# Altium schematic sheet DC-DC_Controller.SchDoc: DC-DC Controller
size A4; CompanyName: swissEmbedded GmbH; Organization: swissEmbedded GmbH; Address1: Landstrasse 18; Address2: 5415 Rieden; Address3: Switzerland; Address4: info@swissembedded.com; DocumentNumber: 1; Revision: A; SheetNumber: 1; SheetTotal: 27
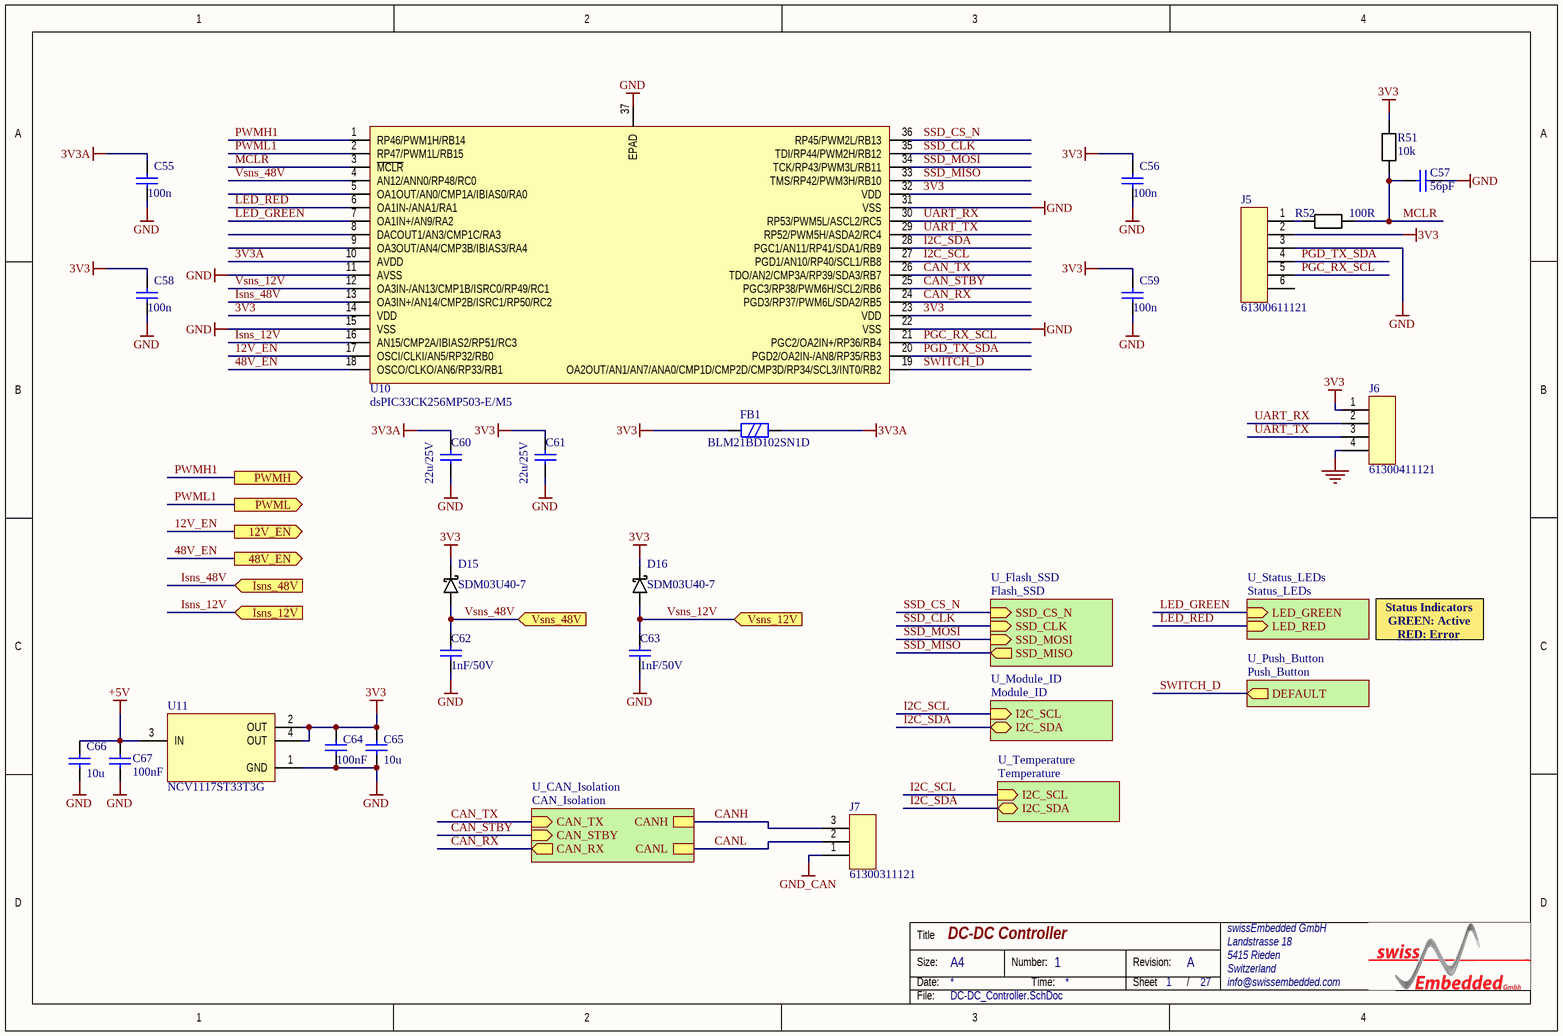
[diagram p0: DC-DC_Controller.SchDoc]

## Parts
C55  100n  [C0603]
C56  100n  [C0603]
C57  56pF  [C0603]
C58  100n  [C0603]
C59  100n  [C0603]
C60  22u/25V  [C0805]
C61  22u/25V  [C0805]
C62  1nF/50V  [C0603]
C63  1nF/50V  [C0603]
C64  100nF  [C0603]
C65  10u  [C1206]
C66  10u  [C1206]
C67  100nF  [C0603]
D15  SDM03U40-7  [SOD523]
D16  SDM03U40-7  [SOD523]
FB1  BLM21BD102SN1D  [R0805]
J5  61300611121  [Header-2.54m-6pin]
J6  61300411121  [Header-2.54m-4pin]
J7  61300311121  [Header-2.54m-3pin]
R51  10k  [R0603]
R52  100R  [R0603]
U10  dsPIC33CK256MP503-E/M5  [UQFN-36]
U11  NCV1117ST33T3G  [SOT223-3]

## Sub-sheets
U_CAN_Isolation = CAN_Isolation: CAN_TX (in), CAN_RX (out), CAN_STBY (in), CANH, CANL
U_Flash_SSD = Flash_SSD: SSD_CS_N (in), SSD_CLK (in), SSD_MOSI (in), SSD_MISO (out)
U_Module_ID = Module_ID: I2C_SCL (in), I2C_SDA (bidir)
U_Push_Button = Push_Button: DEFAULT (out)
U_Status_LEDs = Status_LEDs: LED_RED (in), LED_GREEN (in)
U_Temperature = Temperature: I2C_SCL (in), I2C_SDA (bidir)

## Ports
12V_EN (out), 48V_EN (out), Isns_12V (in), Isns_48V (in), PWMH (out), PWML (out), Vsns_12V (in), Vsns_48V (in)

## Nets
3V3: C56.2 C58.2 C59.2 C61.2 C64.2 C65.2 D15.C D16.C FB1.2 J5.2 J6.1 R51.1 U10.14(VDD) U10.23(VDD) U10.32(VDD) U11.2(OUT) U11.4(OUT)
3V3A: C55.2 C60.2 FB1.1 U10.10(AVDD)
+5V: C66.2 C67.2 U11.3(IN)
GND: C55.1 C56.1 C57.2 C58.1 C59.1 C60.1 C61.1 C62.1 C63.1 C64.1 C65.1 C66.1 C67.1 J5.3 J6.4 U10.11(AVSS) U10.15(VSS) U10.22(VSS) U10.31(VSS) U10.37(EPAD) U11.1(GND)
GND_CAN: J7.1
12V_EN: U10.17(OSCI/CLKI/AN5/RP32/RB0) ; port 12V_EN
48V_EN: U10.18(OSCO/CLKO/AN6/RP33/RB1) ; port 48V_EN
CAN_RX: U10.24(PGD3/RP37/PWM6L/SDA2/RB5) ; sheet U_CAN_Isolation/CAN_RX
CAN_STBY: U10.25(PGC3/RP38/PWM6H/SCL2/RB6) ; sheet U_CAN_Isolation/CAN_STBY
CAN_TX: U10.26(TDO/AN2/CMP3A/RP39/SDA3/RB7) ; sheet U_CAN_Isolation/CAN_TX
CANH: J7.3 ; sheet U_CAN_Isolation/CANH
CANL: J7.2 ; sheet U_CAN_Isolation/CANL
I2C_SCL: U10.27(PGD1/AN10/RP40/SCL1/RB8) ; sheet U_Module_ID/I2C_SCL, sheet U_Temperature/I2C_SCL
I2C_SDA: U10.28(PGC1/AN11/RP41/SDA1/RB9) ; sheet U_Module_ID/I2C_SDA, sheet U_Temperature/I2C_SDA
Isns_12V: U10.16(AN15/CMP2A/IBIAS2/RP51/RC3) ; port Isns_12V
Isns_48V: U10.13(OA3IN+/AN14/CMP2B/ISRC1/RP50/RC2) ; port Isns_48V
LED_GREEN: U10.7(OA1IN+/AN9/RA2) ; sheet U_Status_LEDs/LED_GREEN
LED_RED: U10.6(OA1IN-/ANA1/RA1) ; sheet U_Status_LEDs/LED_RED
MCLR: C57.1 R51.2 R52.2 U10.3(~{MCLR})
PGC_RX_SCL: J5.5 U10.21(PGC2/OA2IN+/RP36/RB4)
PGD_TX_SDA: J5.4 U10.20(PGD2/OA2IN-/AN8/RP35/RB3)
PWMH1: U10.1(RP46/PWM1H/RB14) ; port PWMH
PWML1: U10.2(RP47/PWM1L/RB15) ; port PWML
SSD_CLK: U10.35(TDI/RP44/PWM2H/RB12) ; sheet U_Flash_SSD/SSD_CLK
SSD_CS_N: U10.36(RP45/PWM2L/RB13) ; sheet U_Flash_SSD/SSD_CS_N
SSD_MISO: U10.33(TMS/RP42/PWM3H/RB10) ; sheet U_Flash_SSD/SSD_MISO
SSD_MOSI: U10.34(TCK/RP43/PWM3L/RB11) ; sheet U_Flash_SSD/SSD_MOSI
SWITCH_D: U10.19(OA2OUT/AN1/AN7/ANA0/CMP1D/CMP2D/CMP3D/RP34/SCL3/INT0/RB2) ; sheet U_Push_Button/DEFAULT
UART_RX: J6.2 U10.30(RP53/PWM5L/ASCL2/RC5)
UART_TX: J6.3 U10.29(RP52/PWM5H/ASDA2/RC4)
Vsns_12V: C63.2 D16.A U10.12(OA3IN-/AN13/CMP1B/ISRC0/RP49/RC1) ; port Vsns_12V
Vsns_48V: C62.2 D15.A U10.4(AN12/ANN0/RP48/RC0) ; port Vsns_48V
NetJ5_1: J5.1 R52.1

Not connected (* = marked no-connect by the designer): J5 6; U10 5(OA1OUT/AN0/CMP1A/IBIAS0/RA0) 8(DACOUT1/AN3/CMP1C/RA3) 9(OA3OUT/AN4/CMP3B/IBIAS3/RA4)

## Notes on the sheet
- Status Indicators
  GREEN: Active
  RED: Error
- Title
- Size:
- Date:
- A4
- Number:
- Time:
- Revision:
- Sheet
- /
- File:

## Library data of the parts
C55 C56 C58 C59 = CAP_YAG_CC0603KRX7R9BB104_X7R: 100nF ±10% 50V; Manufacturer: Yageo; Tolerance: +-10%; Type: X7R; Voltage (V): 50; Part Number: CAP_YAG_CC0603KRX7R9BB104_X7R; Manufacturer Part Number: CC0603KRX7R9BB104; Category: Capacitor; Package / Case: 0603; Capacitor (Farad): 100n; Thickness (mm): 0.8; Value: 100n; Price: 0.1; Supplier: mouser; Supplier Part Number: 603-CC0603KRX7R9BB104
C57 = CAP: 330pF ± 5% 50V; Manufacturer: Yageo; Manufacturer Part Number: CC0603JRNPO9BN560; Value: 56pF; Price: 0.1; Supplier: mouser; Supplier Part Number: 603-CC603JRNPO9BN560
C60 C61 = CAP: 22uF ±10% 25V; Manufacturer: Yageo; Manufacturer Part Number: CC0805MKX5R8BB226; Value: 22u/25V; Price: 0.4; Supplier: mouser; Supplier Part Number: 603-CC805MKX5R8BB226
C62 C63 = CAP: 1nF ±10% 50V; Manufacturer: Yageo; Manufacturer Part Number: CC0603KRNPO9BN102; Value: 1nF/50V; Price: 0.1; Supplier: mouser; Supplier Part Number: 603-CC0603KRNPO9BN102
C64 C67 = 100nF ± 10% 50V: Manufacturer: Yageo; Manufacturer Part Number: CC0603KRX7R9BB104; Value: 100nF; Supplier: Mouser; Supplier Part Number: 603-CC603KRX7R9BB104; Price: 0.1
C65 C66 = 10uF ± 10% 25V: Manufacturer: Yageo; Manufacturer Part Number: CC1206KKX7R8BB106; Tolerance: +-10%; Type: X7R; Voltage (V): 25; Category: Capacitor; Value: 10u; Price: 0.44; Supplier: Mouser; Supplier Part Number: 603-CC126KKX7R8BB106
D15 D16 = SDM03U40-7: Schottky Diodes & Rectifiers 40V 150mW; Manufacturer: Diodes Incorporated; Manufacturer Part Number: SDM03U40-7; Value: SDM03U40-7; Supplier: mouser; Supplier Part Number: 621-SDM03U40-F; Price: 0.23
FB1 = SMD_FB: FERRITE BEAD 1 KOHM 0805 1LN; Manufacturer: Murata Electronics; Value: BLM21BD102SN1D; Manufacturer Part Number: BLM21BD102SN1D; Supplier: mouser; Supplier Part Number: 81-BLM21B102S; Price: 0.15
J5 = 6PinConnector: 6 Pins 2.54mm Pitch Male Connector; Manufacturer: Wurth Elektronik; Manufacturer Part Number: 61300611121; Price: 0.33; Supplier: mouser; Supplier Part Number: 710-61300611121; Value: 61300611121
J6 = 61300411121: Headers & Wire Housings WR-PHD 2.54mm Hdr 4P Single Str Gold; Manufacturer: Wurth; Manufacturer Part Number: 61300411121; Price: 0.2; Supplier: Mouser; Supplier Part Number: 710-61300411121; Value: 61300411121
J7 = 61300311121: Headers & Wire Housings WR-PHD 2.54mm Hdr 3P Single Str Gold; Manufacturer: Wurth; Manufacturer Part Number: 61300311121; Price: 0.13; Supplier: Mouser; Supplier Part Number: 710-61300311121; Value: 61300311121
R51 = RES: 0.1W/ 10kohm±1%; Manufacturer Part Number: RC0603FR-0710KL; Manufacturer: Yageo; Value: 10k; Supplier: mouser; Supplier Part Number: 603-RC0603FR-0710KL; Price: 0.1
R52 = RES: 0.1W/ 100 ohm±1%; Manufacturer Part Number: RC0603FR-07100RL; Manufacturer: Yageo; Value: 100R; Supplier: mouser; Supplier Part Number: 603-RC0603FR-07100RL; Price: 0.1
U10 = dsPIC33CK256MP503-E/M5: Digital Signal Processors & Controllers - DSP, DSC 16 Bit DSC, 256KB Flash, 24KB RAM, 100MHz, 28Pin, 3 OpAmp, 3 Comp, PTG, CAN-FD; Manufacturer: Microchip Technology; Alternative Part Number: dsPIC33CK128MP203-I/M5; Manufacturer Part Number: dsPIC33CK256MP503-E/M5; Value: dsPIC33CK256MP503-E/M5; Price: 4; Supplier: Mouser; Supplier Part Number: 579-PIC33CK256MP503E
U11 = NCV1117ST33T3G: LDO Voltage Regulators 3.3V 1.0A Automotive; Manufacturer: onsemi; Price: 0.7; Manufacturer Part Number: NCV1117ST33T3G; Supplier Part Number: 863-NCV1117ST33T3G; Value: NCV1117ST33T3G; Supplier: Mouser